# Altium project REO_THE_BOYS.PrjPcb
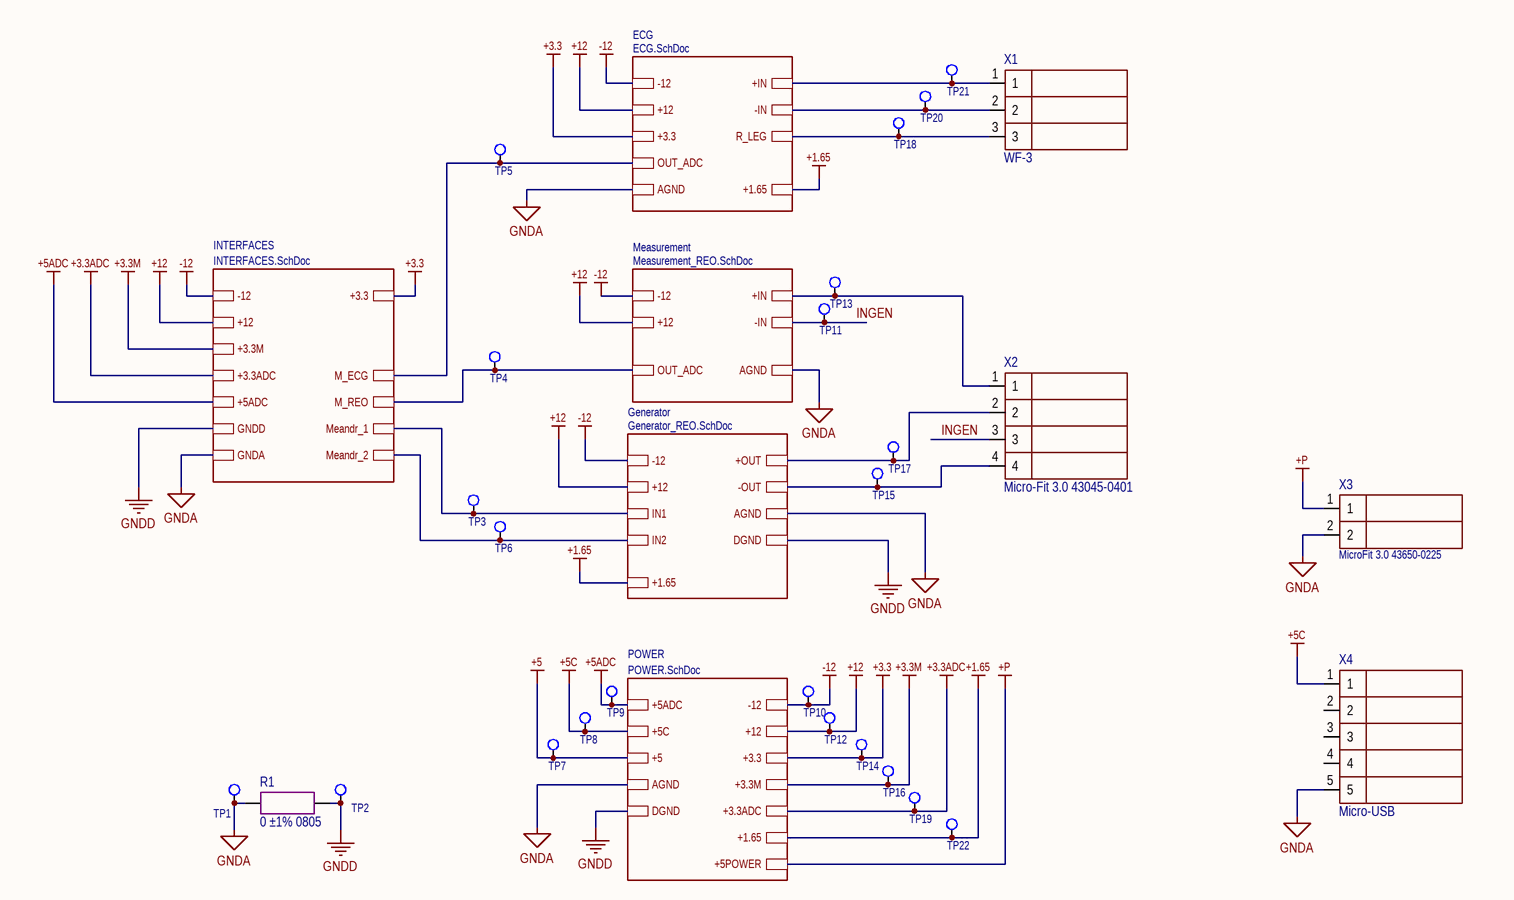
[diagram p0: REO_ECG.SchDoc]
6 sheets, 216 parts. Net scope: hierarchical (ports join the sheet entries above them; power ports are global).
Board file: REO_ECG.PcbDoc
Sheets:
  REO_ECG.SchDoc
    Generator = Generator_REO.SchDoc
    Measurement = Measurement_REO.SchDoc
    POWER = POWER.SchDoc
    ECG = ECG.SchDoc
    INTERFACES = INTERFACES.SchDoc

## Sheet REO_ECG.SchDoc
size 420 x 297 mm; SheetNumber: 1; SheetTotal: 6

### Parts
R1  0 ±1% 0805  [RES: SMD 0805 MD IPC 782]
TP1  Test point  [Test Point]  (value not drawn)  (net tie)
TP2  Test point  [Test Point]  (value not drawn)  (net tie)
TP3  Test point  [Test Point]  (value not drawn)  (net tie)
TP4  Test point  [Test Point]  (value not drawn)  (net tie)
TP5  Test point  [Test Point]  (value not drawn)  (net tie)
TP6  Test point  [Test Point]  (value not drawn)  (net tie)
TP7  Test point  [Test Point]  (value not drawn)  (net tie)
TP8  Test point  [Test Point]  (value not drawn)  (net tie)
TP9  Test point  [Test Point]  (value not drawn)  (net tie)
TP10  Test point  [Test Point]  (value not drawn)  (net tie)
TP11  Test point  [Test Point]  (value not drawn)  (net tie)
TP12  Test point  [Test Point]  (value not drawn)  (net tie)
TP13  Test point  [Test Point]  (value not drawn)  (net tie)
TP14  Test point  [Test Point]  (value not drawn)  (net tie)
TP15  Test point  [Test Point]  (value not drawn)  (net tie)
TP16  Test point  [Test Point]  (value not drawn)  (net tie)
TP17  Test point  [Test Point]  (value not drawn)  (net tie)
TP18  Test point  [Test Point]  (value not drawn)  (net tie)
TP19  Test point  [Test Point]  (value not drawn)  (net tie)
TP20  Test point  [Test Point]  (value not drawn)  (net tie)
TP21  Test point  [Test Point]  (value not drawn)  (net tie)
TP22  Test point  [Test Point]  (value not drawn)  (net tie)
X1  WF-3  [CON: 3pin wf-3]
X2  Micro-Fit 3.0 43045-0401  [CON: 4pin Molex MicroFit 3.0 43045-0401]
X3  MicroFit 3.0 43650-0225  [CON: 2pin Molex MicroFit 3.0 43650-0225]
X4  Micro-USB  [CON: 5pin USB Micro]

### Sub-sheets
ECG = ECG.SchDoc: AGND, -12, +12, +3.3, +IN, -IN, OUT_ADC, R_LEG, +1.65
Generator = Generator_REO.SchDoc: AGND, -OUT, IN1, +OUT, -12, +12, IN2, DGND, +1.65
INTERFACES = INTERFACES.SchDoc: Meandr_1, M_ECG, GNDD, GNDA, M_REO, Meandr_2, +5ADC, +3.3ADC, +3.3M, +12, -12, +3.3
Measurement = Measurement_REO.SchDoc: AGND, -12, +12, +IN, -IN, OUT_ADC
POWER = POWER.SchDoc: AGND, -12, +12, +3.3, +5ADC, +3.3M, +5C, +5, DGND, +3.3ADC, +1.65, +5POWER

### Nets
+1.65: TP22.1 ; sheet Generator/+1.65, sheet POWER/+1.65, sheet ECG/+1.65
+3.3: TP14.1 ; sheet POWER/+3.3, sheet ECG/+3.3, sheet INTERFACES/+3.3
+3.3ADC: TP19.1 ; sheet POWER/+3.3ADC, sheet INTERFACES/+3.3ADC
+3.3M: TP16.1 ; sheet POWER/+3.3M, sheet INTERFACES/+3.3M
+5: TP7.1 ; sheet POWER/+5
+5ADC: TP9.1 ; sheet POWER/+5ADC, sheet INTERFACES/+5ADC
+5C: TP8.1 X4.1 ; sheet POWER/+5C
+12: TP12.1 ; sheet Generator/+12, sheet Measurement/+12, sheet POWER/+12, sheet ECG/+12, sheet INTERFACES/+12
+P: X3.1 ; sheet POWER/+5POWER
-12: TP10.1 ; sheet Generator/-12, sheet Measurement/-12, sheet POWER/-12, sheet ECG/-12, sheet INTERFACES/-12
GNDA: R1.1 TP1.1 X3.2 X4.5 ; sheet Generator/AGND, sheet Measurement/AGND, sheet POWER/AGND, sheet ECG/AGND, sheet INTERFACES/GNDA
GNDD: R1.2 TP2.1 ; sheet Generator/DGND, sheet POWER/DGND, sheet INTERFACES/GNDD  [project net GND]
INGEN: TP11.1 X2.3 ; sheet Measurement/-IN
M1: TP3.1 ; sheet Generator/IN1, sheet INTERFACES/Meandr_1
M2: TP6.1 ; sheet Generator/IN2, sheet INTERFACES/Meandr_2
NetC7_1: TP15.1 X2.4 ; sheet Generator/-OUT
NetC8_1: TP17.1 X2.2 ; sheet Generator/+OUT
NetC32_2: TP13.1 X2.1 ; sheet Measurement/+IN
NetC40_2: TP20.1 X1.2 ; sheet ECG/-IN
NetC41_2: TP21.1 X1.1 ; sheet ECG/+IN
NetC42_2: TP18.1 X1.3 ; sheet ECG/R_LEG
NetC47_1: TP5.1 ; sheet ECG/OUT_ADC, sheet INTERFACES/M_ECG
NetDA14_1: TP4.1 ; sheet Measurement/OUT_ADC, sheet INTERFACES/M_REO

Not connected (* = marked no-connect by the designer): X4 2 3 4

### Notes on the sheet
- Перв. примен.
- 3707.00000000 ЭИТ-1
- Справ. №
- Подп. и дата
- Инв. № дубл.
- Взам. инв. №
- Разраб.
- Изм.
- Лист
- № докум.
- Подп.
- Дата
- Лит.
- Масса
- Масштаб
- Пров.
- Т.контр.
- Листов
- Инв. № подл.
- Утв.
- Н.контр.
- 2.106-A3
- Копировал
- Формат А3

### Library data of the parts
R1 = 0 ±1% 0805: Code: 6094342239; Name: Резистор 0R ±1% 0805
X1 = 3 pin WF-3: Code: 6313932013; Name: Вилка WF-3
X2 = 4 pin MicroFit DR R Molex: Code: *; Name: *
X3 = 2 pin MicroFit SR Molex: Name: Вилка Micro-Fit 3.0 43650-0225, Molex; Code: 6319211711
X4 = 5 pin USB Micro SMD: Code: 6319209171; Name: Розетка 10118194-0001LF, Amphenol

## Sheet Generator_REO.SchDoc
size 420 x 297 mm; SheetNumber: 2; SheetTotal: 6
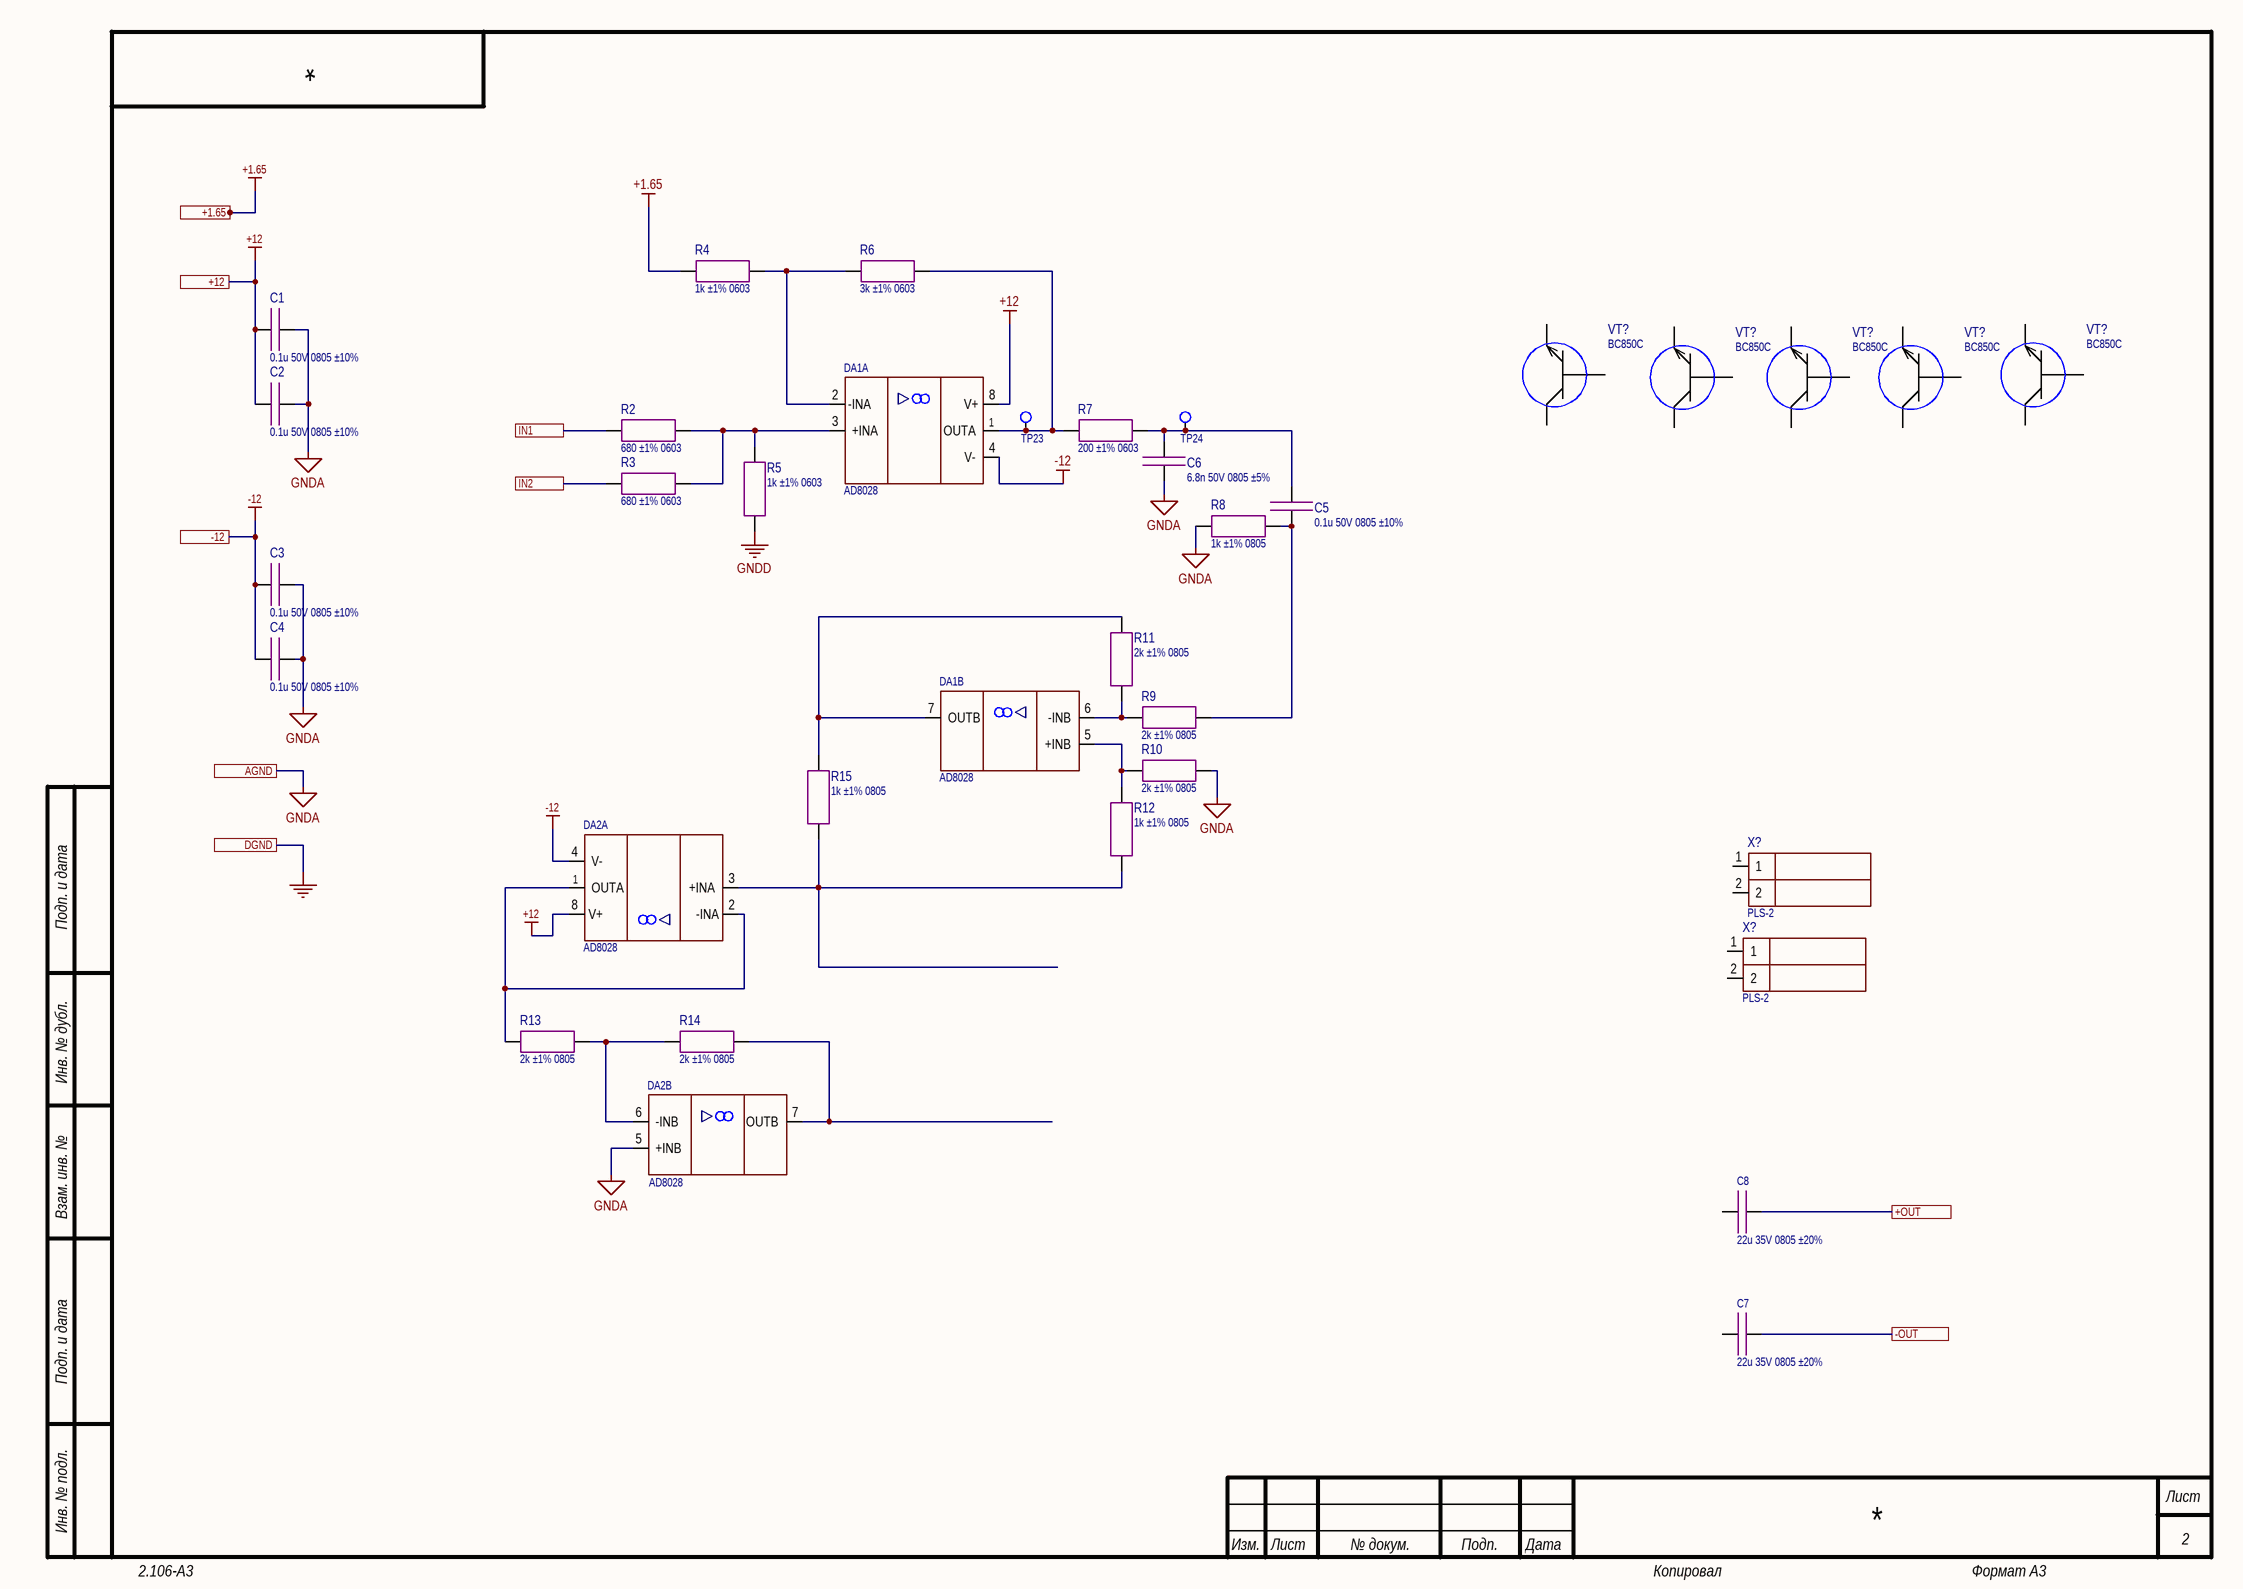
[diagram p1: Generator_REO.SchDoc]

### Parts
(Parts that share a designator on the sheet are numbered #1, #2 ... from top to bottom, then left to right.)
C1  0.1u 50V 0805 ±10%  [CAP: SMD 0805 MD IPC 782]
C2  0.1u 50V 0805 ±10%  [CAP: SMD 0805 MD IPC 782]
C3  0.1u 50V 0805 ±10%  [CAP: SMD 0805 MD IPC 782]
C4  0.1u 50V 0805 ±10%  [CAP: SMD 0805 MD IPC 782]
C5  0.1u 50V 0805 ±10%  [CAP: SMD 0805 MD IPC 782]
C6  6.8n 50V 0805 ±5%  [CAP: SMD 0805 MD IPC 782]
C7  22u 35V 0805 ±20%  [CAP: SMD 0805 MD IPC 782]
C8  22u 35V 0805 ±20%  [CAP: SMD 0805 MD IPC 782]
DA1  AD8028  [IC: SOIC 8]  (parts A,B of 2)
DA2  AD8028  [IC: SOIC 8]  (parts A,B of 2)
R2  680 ±1% 0603  [RES: SMD 0603 MD IPC 782]
R3  680 ±1% 0603  [RES: SMD 0603 MD IPC 782]
R4  1k ±1% 0603  [RES: SMD 0603 MD IPC 782]
R5  1k ±1% 0603  [RES: SMD 0603 MD IPC 782]
R6  3k ±1% 0603  [RES: SMD 0603 MD IPC 782]
R7  200 ±1% 0603  [RES: SMD 0603 MD IPC 782]
R8  1k ±1% 0805  [RES: SMD 0805 MD IPC 782]
R9  2k ±1% 0805  [RES: SMD 0805 MD IPC 782]
R10  2k ±1% 0805  [RES: SMD 0805 MD IPC 782]
R11  2k ±1% 0805  [RES: SMD 0805 MD IPC 782]
R12  1k ±1% 0805  [RES: SMD 0805 MD IPC 782]
R13  2k ±1% 0805  [RES: SMD 0805 MD IPC 782]
R14  2k ±1% 0805  [RES: SMD 0805 MD IPC 782]
R15  1k ±1% 0805  [RES: SMD 0805 MD IPC 782]
TP23  Test point  [Test Point]  (value not drawn)  (net tie)
TP24  Test point  [Test Point]  (value not drawn)  (net tie)
VT?#1  BC850C  [IC: SOT 23]
VT?#2  BC850C  [IC: SOT 23]
VT?#3  BC850C  [IC: SOT 23]
VT?#4  BC850C  [IC: SOT 23]
VT?#5  BC850C  [IC: SOT 23]
X?#1  PLS-2  [CON: 2PIN PLS 2]
X?#2  PLS-2  [CON: 2PIN PLS 2]

### Ports
+1.65 (see REO_ECG[2C], ECG[4A], POWER[1A]), +12 (see REO_ECG[2B], ECG[4A], INTERFACES[4A], Measurement_REO[4A], POWER[1B]), +OUT (see REO_ECG[3B]), -12 (see REO_ECG[2B], ECG[4A], INTERFACES[4A], Measurement_REO[4A], POWER[1B]), -OUT (see REO_ECG[3B]), AGND (see REO_ECG[3B], ECG[4B], Measurement_REO[4A], POWER[1B]), DGND (see REO_ECG[3B], POWER[1B]), IN1 (see REO_ECG[2B]), IN2 (see REO_ECG[2B])

### Nets
+1.65: R4.1 ; port +1.65
+12: C1.2 C2.2 DA1.8(V+) DA2.8(V+) ; port +12
-12: C3.2 C4.2 DA1.4(V-) DA2.4(V-) ; port -12
GND: R5.1 ; port DGND  [also labelled GNDD]
GNDA: C1.1 C2.1 C3.1 C4.1 C6.2 DA2.5(+INB) R8.1 R10.2 ; port AGND
M1: R2.1 ; port IN1
M2: R3.1 ; port IN2
NetC5_1: C5.1 R8.2 R9.2
NetC5_2: C5.2 C6.1 R7.2 TP24.1
NetC7_1: C7.1 ; port -OUT
NetC8_1: C8.1 ; port +OUT
NetDA1_1: DA1.1(OUTA) R6.2 R7.1 TP23.1
NetDA1_2: DA1.2(-INA) R4.2 R6.1
NetDA1_3: DA1.3(+INA) R2.2 R3.2 R5.2
NetDA1_5: DA1.5(+INB) R10.1 R12.2
NetDA1_6: DA1.6(-INB) R9.1 R11.2
NetDA1_7: DA1.7(OUTB) R11.1 R15.1
NetDA2_1: DA2.1(OUTA) DA2.2(-INA) R13.1
NetDA2_3: DA2.3(+INA) R12.1 R15.2
NetDA2_6: DA2.6(-INB) R13.2 R14.1
NetDA2_7: DA2.7(OUTB) R14.2

Not connected (* = marked no-connect by the designer): C7 2; C8 2; VT?#1 1 2 3; VT?#2 1 2 3; VT?#3 1 2 3; VT?#4 1 2 3; VT?#5 1 2 3; X?#1 1 2; X?#2 1 2

### Notes on the sheet
- Подп. и дата
- Инв. № дубл.
- Взам. инв. №
- Инв. № подл.
- Изм.
- Лист
- № докум.
- Подп.
- Дата
- 2.106-A3
- Копировал
- Формат А3

### Library data of the parts
C1-C5 = 0.1u 50V 0805 ±10%: Code: 6279254871; Name: Конденсатор X7R 50V 0,1uF ±10% 0805
C6 = 6.8n 50V 0805 ±5%: Code: 6279352311; Name: Конденсатор NPO 50V 6800pF ±5% 0805
C7 C8 = 22u 35V 0805 ±20%: Code: 6279375691; Name: Конденсатор X5R 35V 22uF±20% 0805
DA1 DA2 = AD8028_part
R2 R3 = 680 ±1% 0603: Code: 6069180761; Name: Резистор 680R ±1% 0603
R4 R5 = 1k ±1% 0603: Code: 6069174188; Name: Резистор 1k ±1% 0603
R6 = 3k ±1% 0603: Code: 6094357331; Name: Резистор 3К ±1% 0603
R7 = 200 ±1% 0603: Code: 6069180621; Name: Резистор 200R±1% 0603
R8 R12 R15 = 1k ±1% 0805: Code: 6027158691; Name: Резистор RC0805FR-071KL, Yageo
R9-R11 R13 R14 = 2k ±1% 0805: Code: 6094352561; Name: Резистор 2k±1%  0805
VT?#1-VT?#5 = BJT NPN BC850C: Code: 6340001151; Name: Транзистор BC850C,215, Nexperia
X?#1 X?#2 = 2 pin PLS 2: Code: 6313952321; Name: Вилка PLS-2

## Sheet Measurement_REO.SchDoc
size 420 x 297 mm; SheetNumber: 4; SheetTotal: 6
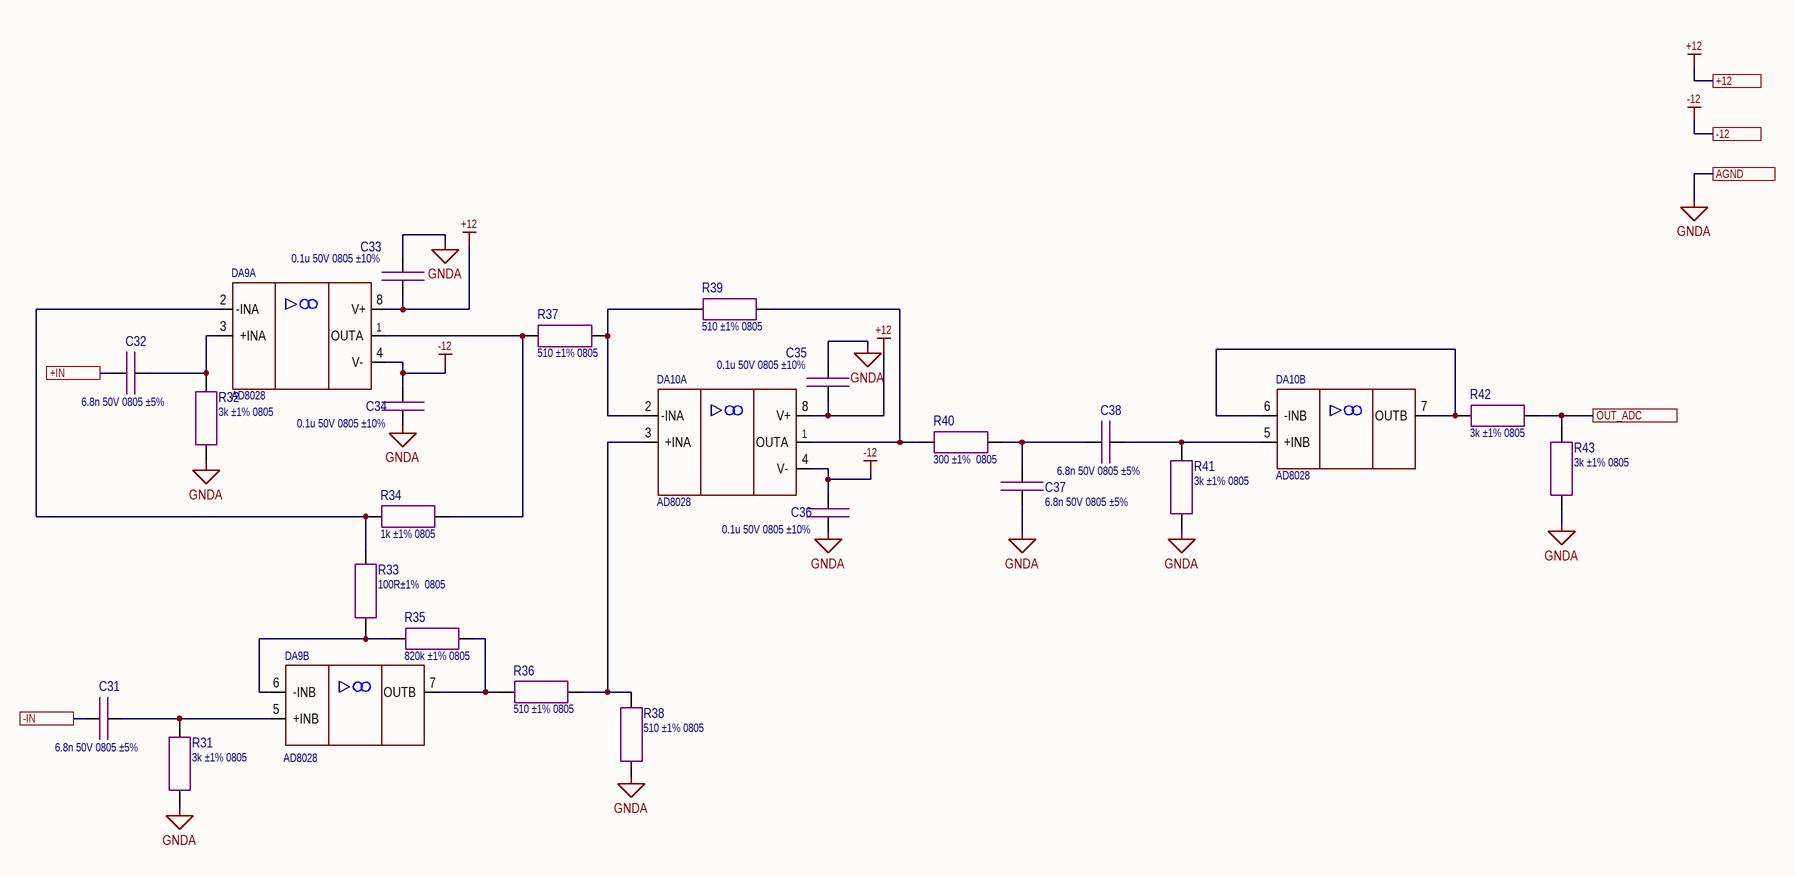
[diagram p2: Measurement_REO.SchDoc]

### Parts
C31  6.8n 50V 0805 ±5%  [CAP: SMD 0805 MD IPC 782]
C32  6.8n 50V 0805 ±5%  [CAP: SMD 0805 MD IPC 782]
C33  0.1u 50V 0805 ±10%  [CAP: SMD 0805 MD IPC 782]
C34  0.1u 50V 0805 ±10%  [CAP: SMD 0805 MD IPC 782]
C35  0.1u 50V 0805 ±10%  [CAP: SMD 0805 MD IPC 782]
C36  0.1u 50V 0805 ±10%  [CAP: SMD 0805 MD IPC 782]
C37  6.8n 50V 0805 ±5%  [CAP: SMD 0805 MD IPC 782]
C38  6.8n 50V 0805 ±5%  [CAP: SMD 0805 MD IPC 782]
DA9  AD8028  [IC: SOIC 8]  (parts A,B of 2)
DA10  AD8028  [IC: SOIC 8]  (parts A,B of 2)
R31  3k ±1% 0805  [RES: SMD 0805 MD IPC 782]
R32  3k ±1% 0805  [RES: SMD 0805 MD IPC 782]
R33  100R±1%  0805  [RES: SMD 0805 MD IPC 782]
R34  1k ±1% 0805  [RES: SMD 0805 MD IPC 782]
R35  820k ±1% 0805  [RES: SMD 0805 MD IPC 782]
R36  510 ±1% 0805  [RES: SMD 0805 MD IPC 782]
R37  510 ±1% 0805  [RES: SMD 0805 MD IPC 782]
R38  510 ±1% 0805  [RES: SMD 0805 MD IPC 782]
R39  510 ±1% 0805  [RES: SMD 0805 MD IPC 782]
R40  300 ±1%  0805  [RES: SMD 0805 MD IPC 782]
R41  3k ±1% 0805  [RES: SMD 0805 MD IPC 782]
R42  3k ±1% 0805  [RES: SMD 0805 MD IPC 782]
R43  3k ±1% 0805  [RES: SMD 0805 MD IPC 782]

### Ports
+12 (see REO_ECG[2B], ECG[4A], Generator_REO[1A], INTERFACES[4A], POWER[1B]), +IN (see REO_ECG[3B]), -12 (see REO_ECG[2B], ECG[4A], Generator_REO[1B], INTERFACES[4A], POWER[1B]), -IN (see REO_ECG[3B]), AGND (see REO_ECG[3B], ECG[4B], Generator_REO[1B], POWER[1B]), OUT_ADC (see REO_ECG[2B])

### Nets
+12: C33.2 C35.2 DA9.8(V+) DA10.8(V+) ; port +12
-12: C34.1 C36.1 DA9.4(V-) DA10.4(V-) ; port -12
GNDA: C33.1 C34.2 C35.1 C36.2 C37.2 R31.2 R32.2 R38.1 R41.2 R43.1 ; port AGND
INGEN: C31.2 ; port -IN
NetC31_1: C31.1 DA9.5(+INB) R31.1
NetC32_1: C32.1 DA9.3(+INA) R32.1
NetC32_2: C32.2 ; port +IN
NetC37_1: C37.1 C38.2 R40.2
NetC38_1: C38.1 DA10.5(+INB) R41.1
NetDA9_1: DA9.1(OUTA) R34.1 R37.1
NetDA9_2: DA9.2(-INA) R33.2 R34.2
NetDA9_6: DA9.6(-INB) R33.1 R35.2
NetDA9_7: DA9.7(OUTB) R35.1 R36.1
NetDA10_1: DA10.1(OUTA) R39.2 R40.1
NetDA10_2: DA10.2(-INA) R37.2 R39.1
NetDA10_3: DA10.3(+INA) R36.2 R38.2
NetDA10_6: DA10.6(-INB) DA10.7(OUTB) R42.1
NetDA14_1: R42.2 R43.2 ; port OUT_ADC

### Notes on the sheet
- Подп. и дата
- Инв. № дубл.
- Взам. инв. №
- Инв. № подл.
- Изм.
- Лист
- № докум.
- Подп.
- Дата
- 2.106-A3
- Копировал
- Формат А3

### Library data of the parts
C31 C32 C37 C38 = 6.8n 50V 0805 ±5%: as C6 on sheet Generator_REO
C33-C36 = 0.1u 50V 0805 ±10%: as C1 on sheet Generator_REO
DA9 DA10 = AD8028_part
R31 R32 R41-R43 = 3k ±1% 0805: Code: 6094357331; Name: Резистор 3К ±1% 0805
R33 = 100 ±1%  0805: Code: 6094351171; Name: Резистор 100R±1%  0805
R34 = 1k ±1% 0805: as R8 on sheet Generator_REO
R35 = 820k ±1% 0805: Code: 6019041741; Name: Резистор RC0805FR-07820KL, Yageo
R36-R39 = 510 ±1% 0805: Code: 6069137191; Name: Резистор 510R±1%  0805
R40 = 300 ±1%  0805: Code: 6094357025; Name: Резистор 300R±1%  0805

## Sheet POWER.SchDoc
size 420 x 297 mm; SheetNumber: 3; SheetTotal: 6
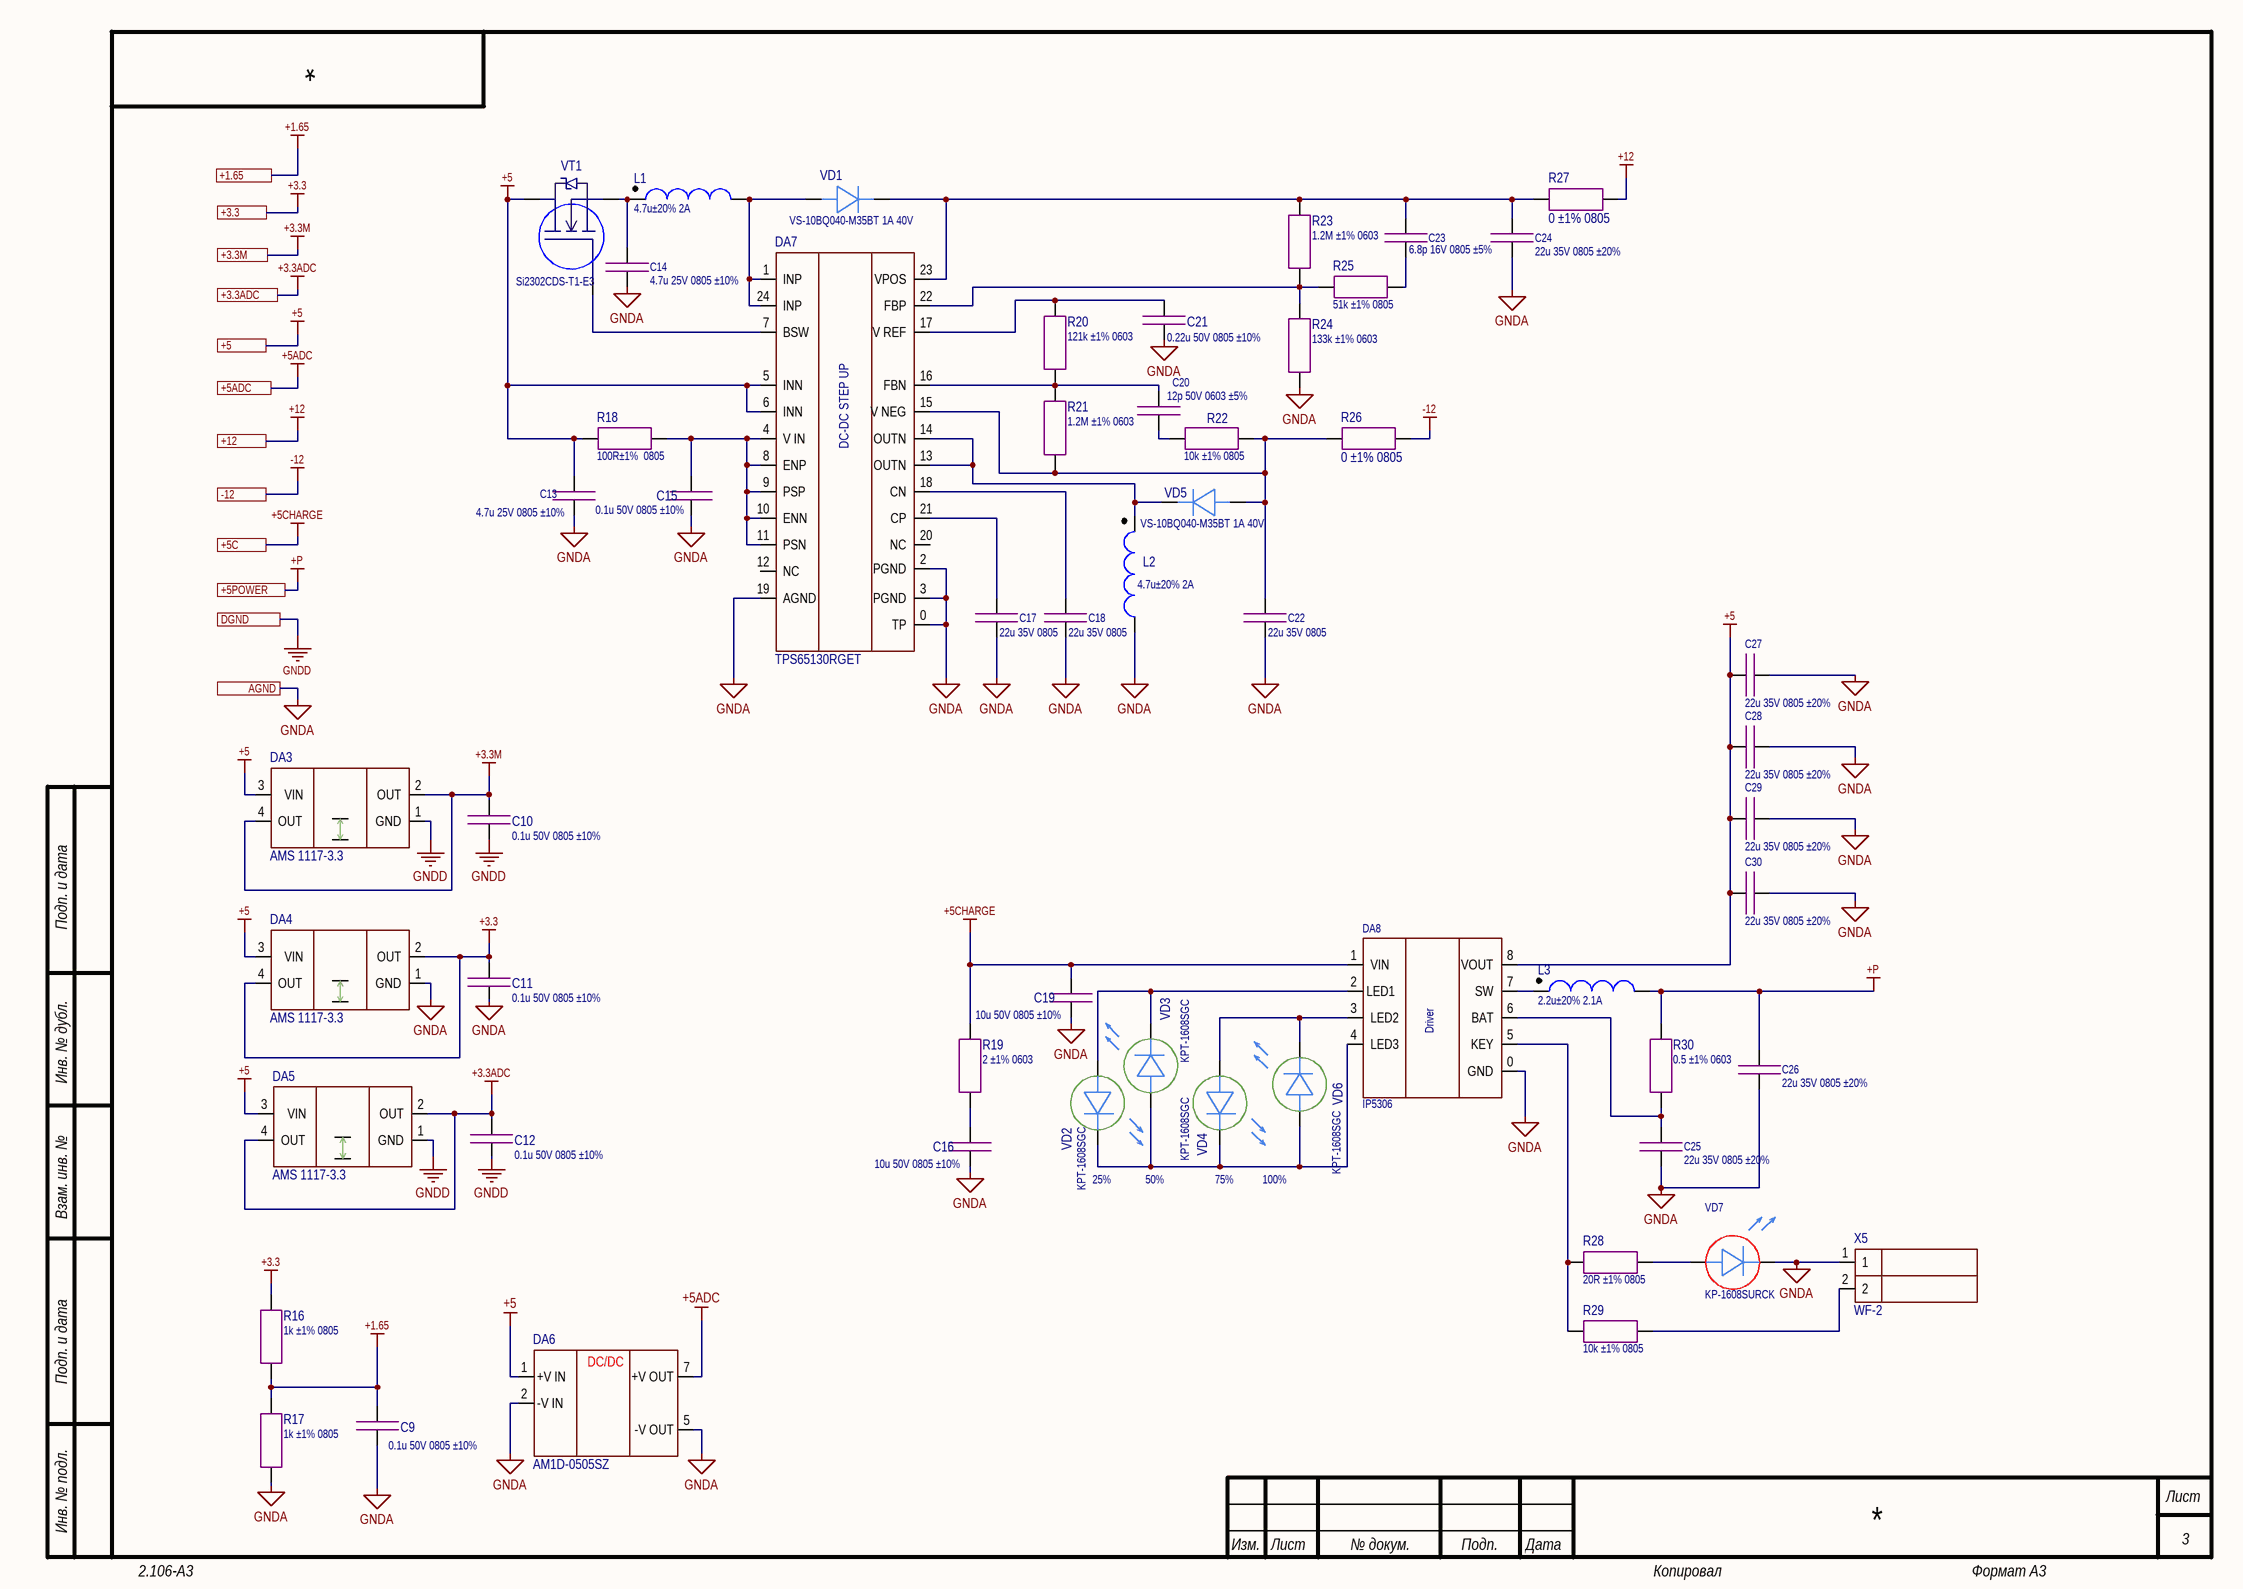
[diagram p3: POWER.SchDoc]

### Parts
C9  0.1u 50V 0805 ±10%  [CAP: SMD 0805 MD IPC 782]
C10  0.1u 50V 0805 ±10%  [CAP: SMD 0805 MD IPC 782]
C11  0.1u 50V 0805 ±10%  [CAP: SMD 0805 MD IPC 782]
C12  0.1u 50V 0805 ±10%  [CAP: SMD 0805 MD IPC 782]
C13  4.7u 25V 0805 ±10%  [CAP: SMD 0805 MD IPC 782]
C14  4.7u 25V 0805 ±10%  [CAP: SMD 0805 MD IPC 782]
C15  0.1u 50V 0805 ±10%  [CAP: SMD 0805 MD IPC 782]
C16  10u 50V 0805 ±10%  [CAP: SMD 0805 MD IPC 782]
C17  22u 35V 0805  [CAP: SMD 0805 MD IPC 782]
C18  22u 35V 0805  [CAP: SMD 0805 MD IPC 782]
C19  10u 50V 0805 ±10%  [CAP: SMD 0805 MD IPC 782]
C20  12p 50V 0603 ±5%  [CAP: SMD 0603 MD IPC 782]
C21  0.22u 50V 0805 ±10%  [CAP: SMD 0805 MD IPC 782]
C22  22u 35V 0805  [CAP: SMD 0805 MD IPC 782]
C23  6.8p 16V 0805 ±5%  [CAP: SMD 0805 MD IPC 782]
C24  22u 35V 0805 ±20%  [CAP: SMD 0805 MD IPC 782]
C25  22u 35V 0805 ±20%  [CAP: SMD 0805 MD IPC 782]
C26  22u 35V 0805 ±20%  [CAP: SMD 0805 MD IPC 782]
C27  22u 35V 0805 ±20%  [CAP: SMD 0805 MD IPC 782]
C28  22u 35V 0805 ±20%  [CAP: SMD 0805 MD IPC 782]
C29  22u 35V 0805 ±20%  [CAP: SMD 0805 MD IPC 782]
C30  22u 35V 0805 ±20%  [CAP: SMD 0805 MD IPC 782]
DA3  AMS 1117-3.3  [IC: SOT 223]
DA4  AMS 1117-3.3  [IC: SOT 223]
DA5  AMS 1117-3.3  [IC: SOT 223]
DA6  AM1D-0505SZ  [AM1D]
DA7  TPS65130RGET  [IC: PVQFN 24]
DA8  IP5306  [IC: SOIC 8 TP]
L1  4.7u±20% 2A  [IND: LPS5030]
L2  4.7u±20% 2A  [IND: LPS5030]
L3  2.2u±20% 2.1A  [IND: LPS3015]
R16  1k ±1% 0805  [RES: SMD 0805 MD IPC 782]
R17  1k ±1% 0805  [RES: SMD 0805 MD IPC 782]
R18  100R±1%  0805  [RES: SMD 0805 MD IPC 782]
R19  2 ±1% 0603  [RES: SMD 0603 MD IPC 782]
R20  121k ±1% 0603  [RES: SMD 0603 MD IPC 782]
R21  1.2M ±1% 0603  [RES: SMD 0603 MD IPC 782]
R22  10k ±1% 0805  [RES: SMD 0805 MD IPC 782]
R23  1.2M ±1% 0603  [RES: SMD 0603 MD IPC 782]
R24  133k ±1% 0603  [RES: SMD 0603 MD IPC 782]
R25  51k ±1% 0805  [RES: SMD 0805 MD IPC 782]
R26  0 ±1% 0805  [RES: SMD 0805 MD IPC 782]
R27  0 ±1% 0805  [RES: SMD 0805 MD IPC 782]
R28  20R ±1% 0805  [RES: SMD 0805 MD IPC 782]
R29  10k ±1% 0805  [RES: SMD 0805 MD IPC 782]
R30  0.5 ±1% 0603  [RES: SMD 0603 MD IPC 782]
VD1  VS-10BQ040-M35BT 1A 40V  [DIODE: SMB]
VD2  KPT-1608SGC  [DIODE: LED 0603(1608) green]
VD3  KPT-1608SGC  [DIODE: LED 0603(1608) green]
VD4  KPT-1608SGC  [DIODE: LED 0603(1608) green]
VD5  VS-10BQ040-M35BT 1A 40V  [DIODE: SMB]
VD6  KPT-1608SGC  [DIODE: LED 0603(1608) green]
VD7  KP-1608SURCK  [DIODE: LED 0603(1608) red]
VT1  Si2302CDS-T1-E3  [IC: SOT 23]
X5  WF-2  [CON: 2pin wf-2]

### Ports
+1.65 (see REO_ECG[3C], ECG[4A], Generator_REO[1A]), +3.3 (see REO_ECG[3C], ECG[4A], INTERFACES[4A]), +3.3ADC (see REO_ECG[3C], INTERFACES[4A]), +3.3M (see REO_ECG[3C], INTERFACES[4A]), +5 (see REO_ECG[2C]), +5ADC (see REO_ECG[2C], INTERFACES[4A]), +5C (see REO_ECG[2C]), +5POWER (see REO_ECG[3C]), +12 (see REO_ECG[3C], ECG[4A], Generator_REO[1A], INTERFACES[4A], Measurement_REO[4A]), -12 (see REO_ECG[3C], ECG[4A], Generator_REO[1B], INTERFACES[4A], Measurement_REO[4A]), AGND (see REO_ECG[2C], ECG[4B], Generator_REO[1B], Measurement_REO[4A]), DGND (see REO_ECG[2C], Generator_REO[1C])

### Nets
+1.65: C9.1 R16.1 R17.2 ; port +1.65
+3.3: C11.1 DA4.2(OUT) DA4.4(OUT) R16.2 ; port +3.3
+3.3ADC: C12.1 DA5.2(OUT) DA5.4(OUT) ; port +3.3ADC
+3.3M: C10.1 DA3.2(OUT) DA3.4(OUT) ; port +3.3M
+5: C13.1 C27.1 C28.1 C29.1 C30.1 DA3.3(VIN) DA4.3(VIN) DA5.3(VIN) DA6.1(+V_IN) DA7.5(INN) DA7.6(INN) DA8.8(VOUT) R18.1 VT1.3 ; port +5
+5ADC: DA6.7(+V_OUT) ; port +5ADC
+5CHARGE: C19.1 DA8.1(VIN) R19.2 ; port +5C  [project net +5C]
+12: R27.2 ; port +12
+P: C26.1 L3.2 R30.2 ; port +5POWER
-12: R26.2 ; port -12
GNDA: C9.2 C11.2 C13.2 C14.2 C15.2 C16.2 C17.2 C18.2 C19.2 C21.2 C22.2 C24.2 C25.2 C26.2 C27.2 C28.2 C29.2 C30.2 DA4.1(GND) DA6.2(-V_IN) DA6.5(-V_OUT) DA7.0(TP) DA7.2(PGND) DA7.3(PGND) DA7.19(AGND) DA8.0(GND) L2.2 R17.1 R24.1 VD7.1 X5.1 ; port AGND
GNDD: C10.2 C12.2 DA3.1(GND) DA5.1(GND) ; port DGND  [project net GND]
NetC14_1: C14.1 L1.1 VT1.2
NetC15_1: C15.1 DA7.4(V_IN) DA7.8(ENP) DA7.9(PSP) DA7.10(ENN) DA7.11(PSN) R18.2
NetC16_1: C16.1 R19.1
NetC17_1: C17.1 DA7.21(CP)
NetC18_1: C18.1 DA7.18(CN)
NetC20_1: C20.1 DA7.16(FBN) R20.1 R21.2
NetC20_2: C20.2 R22.1
NetC21_1: C21.1 DA7.17(V_REF) R20.2
NetC22_1: C22.1 DA7.15(V_NEG) R21.1 R22.2 R26.1 VD5.2
NetC23_1: C23.1 C24.1 DA7.23(VPOS) R23.2 R27.1 VD1.1
NetC23_2: C23.2 R25.2
NetC25_1: C25.1 DA8.6(BAT) R30.1
NetDA7_1: DA7.1(INP) DA7.24(INP) L1.2 VD1.2
NetDA7_7: DA7.7(BSW) VT1.1
NetDA7_13: DA7.13(OUTN) DA7.14(OUTN) L2.1 VD5.1
NetDA7_22: DA7.22(FBP) R23.1 R24.2 R25.1
NetDA8_2: DA8.2(LED1) VD2.2 VD3.1
NetDA8_3: DA8.3(LED2) VD4.2 VD6.1
NetDA8_4: DA8.4(LED3) VD2.1 VD3.2 VD4.1 VD6.2
NetDA8_5: DA8.5(KEY) R28.1 R29.1
NetDA8_7: DA8.7(SW) L3.1
NetR28_2: R28.2 VD7.2
NetR29_2: R29.2 X5.2

Not connected (* = marked no-connect by the designer): DA7 12(NC) 20(NC)

### Notes on the sheet
- (near VD2) 25%
- 50%
- (near VD4) 75%
- 100%
- Подп. и дата
- Инв. № дубл.
- Взам. инв. №
- Инв. № подл.
- Изм.
- Лист
- № докум.
- Подп.
- Дата
- 2.106-A3
- Копировал
- Формат А3
- (in symbol DC-DC: 3-15/-15V TPS65130RGET) DC-DC STEP UP
- (in symbol DC-DC: 5-5V AM1D-0505SZ) DC/DC
- (in symbol IP5306) Driver

### Library data of the parts
C9-C12 C15 = 0.1u 50V 0805 ±10%: as C1 on sheet Generator_REO
C13 C14 = 4.7u 25V 0805 ±10%: Code: 6270000501; Name: Конденсатор X7R 25V 4,7uF±10% 0805
C16 C19 = 10u 50V 0805 ±10%: Code: 6289735441; Name: Конденсатор 12065D106KAT2A, AVX
C17 C18 C22 C24-C30 = 22u 35V 0805 ±20%: as C7 on sheet Generator_REO
C20 = 12p 50V 0603 ±5%: Code: 6279238291; Name: Конденсатор NP0 50V 12pF±5% 0603
C21 = 0.22u 50V 0805 ±10%: Name: Конденсатор 0805B224K500NT, Fenghua
C23 = 6.8p 50V 0805 ±5%: Code: 6219233221; Name: Конденсатор COG 16V 6.8pF±5% 0805
DA3-DA5 = LDO: 15-3.3V AMS1117: Code: 6339112951; Name: Микросхема AMS-1117-3.3
DA6 = DC-DC: 5-5V AM1D-0505SZ: Name: Микросхема AM1D-0505SZ, AIMTEC
DA7 = DC-DC: 3-15/-15V TPS65130RGET: Code: 6339113561; Name: Микросхема TPS65130RGET, TI
L1 L2 = 4.7u±20% 2A: LPS5030; Code: 6339119781; Name: Микросхема LPS5030-472MR(B), Coilcraft
L3 = 2.2u±20% 2.1A: LPS3015; Code: 6319247691; Name: Дроссель LPS3015-222MRC, Coilcraft
R16 R17 = 1k ±1% 0805: as R8 on sheet Generator_REO
R18 = 100 ±1%  0805: as R33 on sheet Measurement_REO
R19 = 2 ±1% 0603: Code: 6069180891; Name: Резистор 2,2k ±1% 0603
R20 = 121k ±1% 0603: Code: 6060001691; Name: Резистор 121K±1% 0603
R21 R23 = 1.2M ±1% 0603: Code: 6069194591; Name: Резистор 1,2M±1% ТК50 0603
R22 R29 = 10k ±1% 0805: Code: 6020003061; Name: Резистор RC0805JR-0710KL
R24 = 133k ±1% 0603: Code: 6027155891; Name: Резистор CRCW0603133KFKEA, Vishay
R25 = 51k ±1% 0805: Code: 6094354057; Name: Резистор 51K±1% 0805
R26 R27 = 0 ±1% 0805: as R1 on sheet REO_ECG
R28 = 20R ±1% 0805: Code: 6094357581; Name: 20R ±1% 0805
R30 = 0.5 ±1% 0603: Name: Резистор 0.5 ±1% 0603
VD1 VD5 = Rectifier 1A 40V: Code: 6349982351; Name: Диод VS-10BQ040-M35BT, Vishay
VD2-VD4 VD6 = LED green 0603: Code: 6340003921; Name: Светодиод KPT-1608SGC, Kingbright
VD7 = LED red 0603: Code: 6349551609; Name: Светодиод KP-1608SURCK
VT1 = MOS N Si2302CDS-T1-E3: Code: 6349982201; Name: Транзистор Si2302CDS-T1-E3,  Vishay
X5 = 2 pin WF-2: Code: 6313952902; Name: Вилка WF-2

## Sheet ECG.SchDoc
size 420 x 297 mm; SheetNumber: 5; SheetTotal: 6
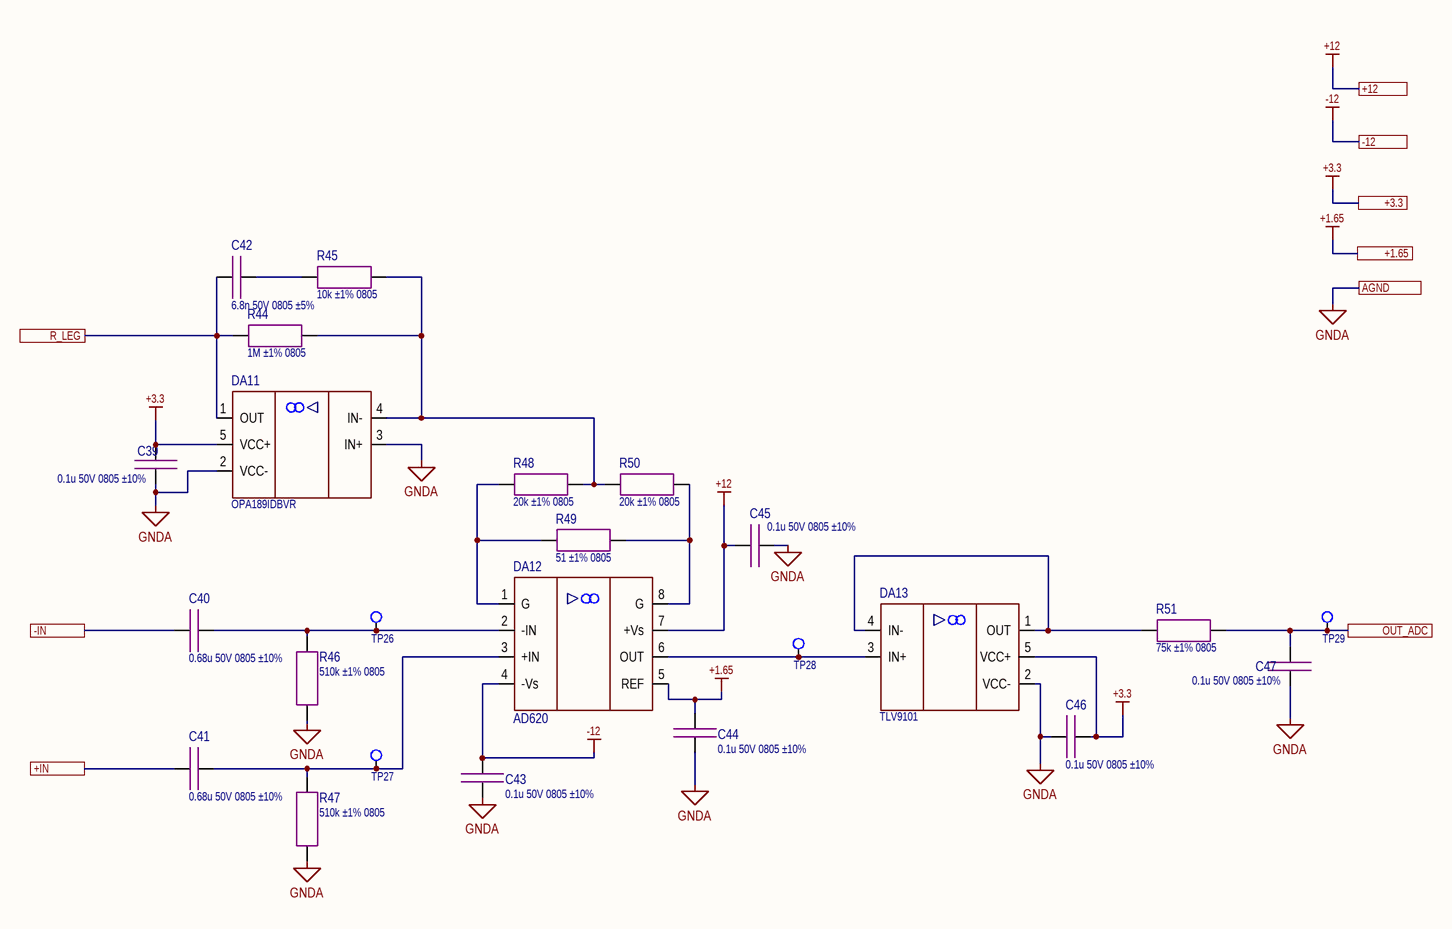
[diagram p4: ECG.SchDoc]

### Parts
C39  0.1u 50V 0805 ±10%  [CAP: SMD 0805 MD IPC 782]
C40  0.68u 50V 0805 ±10%  [CAP: SMD 0805 MD IPC 782]
C41  0.68u 50V 0805 ±10%  [CAP: SMD 0805 MD IPC 782]
C42  6.8n 50V 0805 ±5%  [CAP: SMD 0805 MD IPC 782]
C43  0.1u 50V 0805 ±10%  [CAP: SMD 0805 MD IPC 782]
C44  0.1u 50V 0805 ±10%  [CAP: SMD 0805 MD IPC 782]
C45  0.1u 50V 0805 ±10%  [CAP: SMD 0805 MD IPC 782]
C46  0.1u 50V 0805 ±10%  [CAP: SMD 0805 MD IPC 782]
C47  0.1u 50V 0805 ±10%  [CAP: SMD 0805 MD IPC 782]
DA11  OPA189IDBVR  [IC: SOT 23 5pin]
DA12  AD620  [IC: SOIC 8]
DA13  TLV9101  [IC: SOT 23 5pin]
R44  1M ±1% 0805  [RES: SMD 0805 MD IPC 782]
R45  10k ±1% 0805  [RES: SMD 0805 MD IPC 782]
R46  510k ±1% 0805  [RES: SMD 0805 MD IPC 782]
R47  510k ±1% 0805  [RES: SMD 0805 MD IPC 782]
R48  20k ±1% 0805  [RES: SMD 0805 MD IPC 782]
R49  51 ±1% 0805  [RES: SMD 0805 MD IPC 782]
R50  20k ±1% 0805  [RES: SMD 0805 MD IPC 782]
R51  75k ±1% 0805  [RES: SMD 0805 MD IPC 782]
TP26  Test point  [Test Point]  (value not drawn)  (net tie)
TP27  Test point  [Test Point]  (value not drawn)  (net tie)
TP28  Test point  [Test Point]  (value not drawn)  (net tie)
TP29  Test point  [Test Point]  (value not drawn)  (net tie)

### Ports
+1.65 (see REO_ECG[3B], Generator_REO[1A], POWER[1A]), +3.3 (see REO_ECG[2A], INTERFACES[4A], POWER[1A]), +12 (see REO_ECG[2A], Generator_REO[1A], INTERFACES[4A], Measurement_REO[4A], POWER[1B]), +IN (see REO_ECG[3A]), -12 (see REO_ECG[2A], Generator_REO[1B], INTERFACES[4A], Measurement_REO[4A], POWER[1B]), -IN (see REO_ECG[3A]), AGND (see REO_ECG[2B], Generator_REO[1B], Measurement_REO[4A], POWER[1B]), OUT_ADC (see REO_ECG[2B]), R_LEG (see REO_ECG[3A])

### Nets
+1.65: C44.2 DA12.5(REF) ; port +1.65
+3.3: C39.1 C46.1 DA11.5(VCC+) DA13.5(VCC+) ; port +3.3
+12: C45.1 DA12.7(+Vs) ; port +12
-12: C43.1 DA12.4(-Vs) ; port -12
GNDA: C39.2 C43.2 C44.1 C45.2 C46.2 C47.2 DA11.2(VCC-) DA11.3(IN+) DA13.2(VCC-) R46.1 R47.1 ; port AGND
NetC40_1: C40.1 DA12.2(-IN) R46.2 TP26.1
NetC40_2: C40.2 ; port -IN
NetC41_1: C41.1 DA12.3(+IN) R47.2 TP27.1
NetC41_2: C41.2 ; port +IN
NetC42_1: C42.1 R45.1
NetC42_2: C42.2 DA11.1(OUT) R44.1 ; port R_LEG
NetC47_1: C47.1 R51.2 TP29.1 ; port OUT_ADC
NetDA11_4: DA11.4(IN-) R44.2 R45.2 R48.2 R50.1
NetDA12_1: DA12.1(G) R48.1 R49.1
NetDA12_6: DA12.6(OUT) DA13.3(IN+) TP28.1
NetDA12_8: DA12.8(G) R49.2 R50.2
NetDA13_1: DA13.1(OUT) DA13.4(IN-) R51.1

### Notes on the sheet
- Подп. и дата
- Инв. № дубл.
- Взам. инв. №
- Инв. № подл.
- Изм.
- Лист
- № докум.
- Подп.
- Дата
- 2.106-A3
- Копировал
- Формат А3

### Library data of the parts
C39 C43-C47 = 0.1u 50V 0805 ±10%: as C1 on sheet Generator_REO
C40 C41 = 0.68u 50V 0805 ±10%: Name: Конденсатор 0805B224K500NT, Fenghua
C42 = 6.8n 50V 0805 ±5%: as C6 on sheet Generator_REO
DA11 = OPA189IDBVR: Name: Микросхема OPA189IDBVR
DA13 = TLV9101: Code: 6339115821; Name: Микросхема TLV9101IDBVR
R44 = 1M ±1% 0805: Name: Резистор RC0805FR-071KL, Yageo
R45 = 10k ±1% 0805: as R22 on sheet POWER
R46 R47 = 510k ±1% 0805: Code: 6094357031; Name: Резистор 510K±1% 0805
R48 R50 = 20k ±1% 0805: Code: 6094357581; Name: Резистор 20K±1% 0805
R49 = 51 ±1% 0805: Code: 6094354057; Name: Резистор 51K±1% 0805
R51 = 75k ±1% 0805: Name: Резистор 75К±1% 0805

## Sheet INTERFACES.SchDoc
size 594 x 420 mm; SheetNumber: 6; SheetTotal: 6
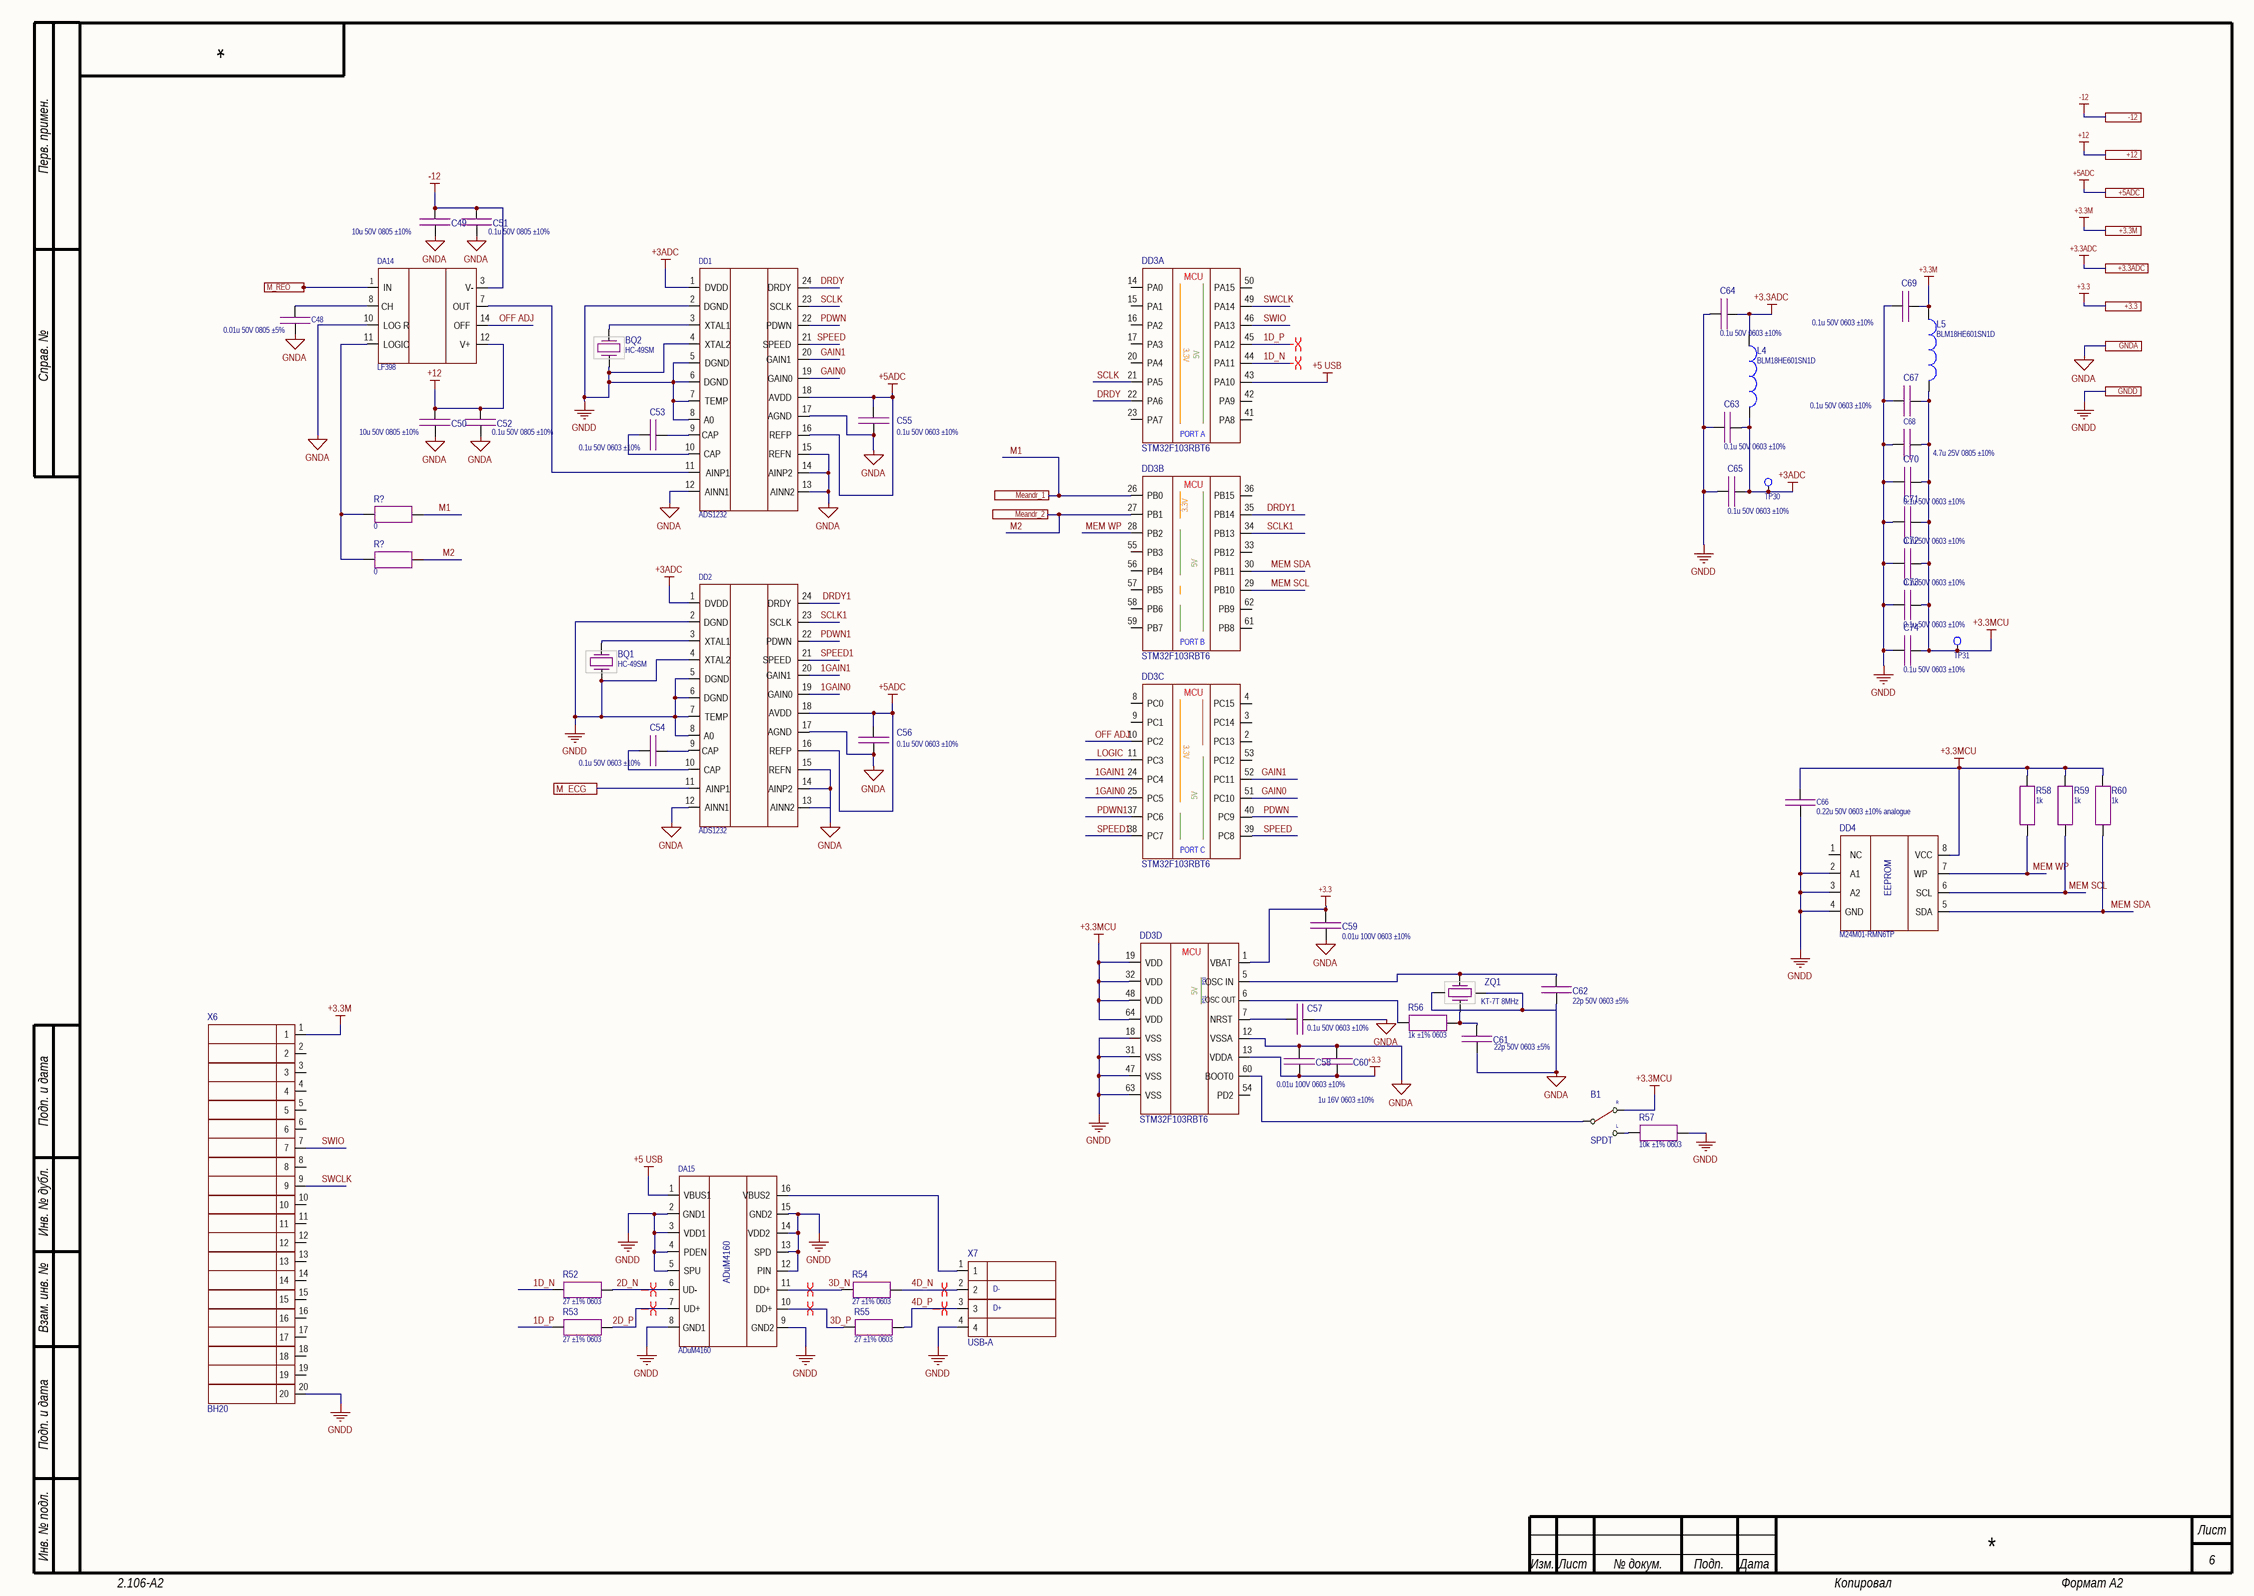
[diagram p5: INTERFACES.SchDoc]

### Parts
(Parts that share a designator on the sheet are numbered #1, #2 ... from top to bottom, then left to right.)
B1  SPDT  [Slide Switch 3 pin]
BQ1  HC-49SM  [CRYSTAL: HC-49SM]
BQ2  HC-49SM  [CRYSTAL: HC-49SM]
C48  0.01u 50V 0805 ±5%  [CAP: SMD 0805 MD IPC 782]
C49  10u 50V 0805 ±10%  [CAP: SMD 0805 MD IPC 782]
C50  10u 50V 0805 ±10%  [CAP: SMD 0805 MD IPC 782]
C51  0.1u 50V 0805 ±10%  [CAP: SMD 0805 MD IPC 782]
C52  0.1u 50V 0805 ±10%  [CAP: SMD 0805 MD IPC 782]
C53  0.1u 50V 0603 ±10%  [CAP: SMD 0603 MD IPC 782]
C54  0.1u 50V 0603 ±10%  [CAP: SMD 0603 MD IPC 782]
C55  0.1u 50V 0603 ±10%  [CAP: SMD 0603 MD IPC 782]
C56  0.1u 50V 0603 ±10%  [CAP: SMD 0603 MD IPC 782]
C57  0.1u 50V 0603 ±10%  [CAP: SMD 0603 MD IPC 782]
C58  0.01u 100V 0603 ±10%  [CAP: SMD 0603 MD IPC 782]
C59  0.01u 100V 0603 ±10%  [CAP: SMD 0603 MD IPC 782]
C60  1u 16V 0603 ±10%  [CAP: SMD 0603 MD IPC 782]
C61  22p 50V 0603 ±5%  [CAP: SMD 0603 MD IPC 782]
C62  22p 50V 0603 ±5%  [CAP: SMD 0603 MD IPC 782]
C63  0.1u 50V 0603 ±10%  [CAP: SMD 0603 MD IPC 782]
C64  0.1u 50V 0603 ±10%  [CAP: SMD 0603 MD IPC 782]
C65  0.1u 50V 0603 ±10%  [CAP: SMD 0603 MD IPC 782]
C66  0.22u 50V 0603 ±10% analogue  [CAP: SMD 0603 MD IPC 782]
C67  0.1u 50V 0603 ±10%  [CAP: SMD 0603 MD IPC 782]
C68  4.7u 25V 0805 ±10%  [CAP: SMD 0805 MD IPC 782]
C69  0.1u 50V 0603 ±10%  [CAP: SMD 0603 MD IPC 782]
C70  0.1u 50V 0603 ±10%  [CAP: SMD 0603 MD IPC 782]
C71  0.1u 50V 0603 ±10%  [CAP: SMD 0603 MD IPC 782]
C72  0.1u 50V 0603 ±10%  [CAP: SMD 0603 MD IPC 782]
C73  0.1u 50V 0603 ±10%  [CAP: SMD 0603 MD IPC 782]
C74  0.1u 50V 0603 ±10%  [CAP: SMD 0603 MD IPC 782]
DA14  LF398  [IC: SOIC 14]
DA15  ADuM4160  [IC: SOIC 16 WIDE]
DD1  ADS1232  [TSSOP-24]
DD2  ADS1232  [TSSOP-24]
DD3  STM32F103RBT6  [MC: LQFP-64]  (parts A,B,C,D of 4)
DD4  M24M01-RMN6TP  [IC: SOIC 8]
L4  BLM18HE601SN1D  [IND: SMD 0603 MD IPC 782]
L5  BLM18HE601SN1D  [IND: SMD 0603 MD IPC 782]
R52  27 ±1% 0603  [IND: SMD 0603 BLM18HE601SN1D]
R53  27 ±1% 0603  [IND: SMD 0603 BLM18HE601SN1D]
R54  27 ±1% 0603  [IND: SMD 0603 BLM18HE601SN1D]
R55  27 ±1% 0603  [IND: SMD 0603 BLM18HE601SN1D]
R56  1k ±1% 0603  [RES: SMD 0603 MD IPC 782]
R57  10k ±1% 0603  [RES: SMD 0603 MD IPC 782]
R58  1k  [RES: SMD 0603 MD IPC 782]
R59  1k  [RES: SMD 0603 MD IPC 782]
R60  1k  [RES: SMD 0603 MD IPC 782]
R?#1  0  [RES: SMD 0603 MD IPC 782]
R?#2  0  [RES: SMD 0603 MD IPC 782]
TP30  Test point  [Test Point]  (value not drawn)  (net tie)
TP31  Test point  [Test Point]  (value not drawn)  (net tie)
X6  BH20  [CON: BH-20]
X7  USB-A  [CON: 4PIN USB B]
ZQ1  KT-7T 8MHz  [CRYSTAL: 3225 4pin]

### Ports
+3.3 (see REO_ECG[2B], ECG[4A], POWER[1A]), +3.3ADC (see REO_ECG[2B], POWER[1A]), +3.3M (see REO_ECG[2B], POWER[1A]), +5ADC (see REO_ECG[2B], POWER[1A]), +12 (see REO_ECG[2B], ECG[4A], Generator_REO[1A], Measurement_REO[4A], POWER[1B]), -12 (see REO_ECG[2B], ECG[4A], Generator_REO[1B], Measurement_REO[4A], POWER[1B]), GNDA (see REO_ECG[2B]), GNDD (see REO_ECG[2B]), M_ECG (see REO_ECG[2B]), M_REO (see REO_ECG[2B]), Meandr_1 (see REO_ECG[2B]), Meandr_2 (see REO_ECG[2B])

### Nets
+3.3: C58.2 C59.1 C60.2 DD3.1(VBAT) DD3.13(VDDA) ; port +3.3
+3.3ADC: C64.2 L4.1 ; port +3.3ADC
+3.3M: C69.2 L5.1 X6.1 ; port +3.3M
+3.3MCU: B1.3 C66.1 C67.1 C68.1 C70.2 C71.2 C72.2 C73.2 C74.2 DD3.19(VDD) DD3.32(VDD) DD3.48(VDD) DD3.64(VDD) DD4.8(VCC) L5.2 R58.2 R59.2 R60.2 TP31.1
+3ADC: C63.1 C65.2 DD1.1(DVDD) DD2.1(DVDD) L4.2 TP30.1
+5 USB: DA15.1(VBUS1) DD3.43(PA10)
+5ADC: C55.1 C56.1 DD1.16(REFP) DD1.18(AVDD) DD2.16(REFP) DD2.18(AVDD) ; port +5ADC
+12: C50.1 C52.1 DA14.12(V+) ; port +12
-12: C49.1 C51.1 DA14.3(V-) ; port -12
GNDA: C48.2 C49.2 C50.2 C51.2 C52.2 C55.2 C56.2 C57.1 C58.1 C59.2 C60.1 C61.2 C62.2 DA14.10(LOG_R) DD1.12(AINN1) DD1.13(AINN2) DD1.14(AINP2) DD1.15(REFN) DD1.17(AGND) DD2.12(AINN1) DD2.13(AINN2) DD2.14(AINP2) DD2.15(REFN) DD2.17(AGND) DD3.12(VSSA) ZQ1.2 ZQ1.4 ; port GNDA
GNDD: BQ1.1 BQ2.1 C63.2 C64.1 C65.1 C66.2 C67.2 C68.2 C69.1 C70.1 C71.1 C72.1 C73.1 C74.1 DA15.2(GND1) DA15.3(VDD1) DA15.4(PDEN) DA15.5(SPU) DA15.8(GND1) DA15.9(GND2) DA15.12(PIN) DA15.13(SPD) DA15.14(VDD2) DA15.15(GND2) DD1.2(DGND) DD1.4(XTAL2) DD2.2(DGND) DD2.4(XTAL2) DD2.5(DGND) DD2.6(DGND) DD2.7(TEMP) DD2.8(A0) DD3.18(VSS) DD3.31(VSS) DD3.47(VSS) DD3.63(VSS) DD4.2(A1) DD4.3(A2) DD4.4(GND) R57.2 X6.20 X7.4 ; port GNDD  [project net GND]
1D_N: DD3.44(PA11) R52.1
1D_P: DD3.45(PA12) R53.1
1GAIN0: DD2.19(GAIN0) DD3.25(PC5)
1GAIN1: DD2.20(GAIN1) DD3.24(PC4)
2D_N: DA15.6(UD-) R52.2
2D_P: DA15.7(UD+) R53.2
3D_N: DA15.11(DD+) R54.1
3D_P: DA15.10(DD+) R55.1
4D_N: R54.2 X7.2
4D_P: R55.2 X7.3
DRDY: DD1.24(DRDY) DD3.22(PA6)
DRDY1: DD2.24(DRDY) DD3.35(PB14)
GAIN0: DD1.19(GAIN0) DD3.51(PC10)
GAIN1: DD1.20(GAIN1) DD3.52(PC11)
LOGIC: DD3.11(PC3)
M1: DD3.26(PB0) R?#1.2 ; port Meandr_1
M2: DD3.27(PB1) R?#2.2 ; port Meandr_2
MEM SCL: DD3.29(PB10) DD4.6(SCL) R59.1
MEM SDA: DD3.30(PB11) DD4.5(SDA) R60.1
MEM WP: DD3.28(PB2) DD4.7(WP) R58.1
OFF ADJ: DA14.14(OFF) DD3.10(PC2)
PDWN: DD1.22(PDWN) DD3.40(PC9)
PDWN1: DD2.22(PDWN) DD3.37(PC6)
SCLK: DD1.23(SCLK) DD3.21(PA5)
SCLK1: DD2.23(SCLK) DD3.34(PB13)
SPEED: DD1.21(SPEED) DD3.39(PC8)
SPEED1: DD2.21(SPEED) DD3.38(PC7)
SWCLK: DD3.49(PA14) X6.9
SWIO: DD3.46(PA13) X6.7
NetB1_1: B1.1 R57.1
NetB1_2: B1.2 DD3.60(BOOT0)
NetBQ1_2: BQ1.2 DD2.3(XTAL1)
NetBQ2_2: BQ2.2 DD1.3(XTAL1)
NetC47_1: DD2.11(AINP1) ; port M_ECG
NetC48_1: C48.1 DA14.8(CH)
NetC53_1: C53.1 DD1.9(CAP)
NetC53_2: C53.2 DD1.10(CAP)
NetC54_1: C54.1 DD2.9(CAP)
NetC54_2: C54.2 DD2.10(CAP)
NetC57_2: C57.2 DD3.7(NRST)
NetC61_1: C61.1 R56.2 ZQ1.1
NetC62_1: C62.1 DD3.5(OSC_IN) ZQ1.3
NetDA14_1: DA14.1(IN) ; port M_REO
NetDA14_7: DA14.7(OUT) DD1.11(AINP1)
NetDA14_11: DA14.11(LOGIC) R?#1.1 R?#2.1
NetDA15_16: DA15.16(VBUS2) X7.1
NetDD1_5: DD1.5(DGND) DD1.6(DGND) DD1.7(TEMP) DD1.8(A0)
NetDD3_6: DD3.6(OSC_OUT) R56.1

Not connected (* = marked no-connect by the designer): DD3 2(PC13) 3(PC14) 4(PC15) 8(PC0) 9(PC1) 14(PA0) 15(PA1) 16(PA2) 17(PA3) 20(PA4) 23(PA7) 33(PB12) 36(PB15) 41(PA8) 42(PA9) 50(PA15) 53(PC12) 54(PD2) 55(PB3) 56(PB4) 57(PB5) 58(PB6) 59(PB7) 61(PB8) 62(PB9); DD4 1(NC); X6 2 3 4 5 6 8 10 11 12 13 14 15 16 17 18 19

### Layout directives
differential pair: 1D_N, 1D_P, 2D_N, 2D_P, 3D_N, 3D_P, 4D_N, 4D_P

### Notes on the sheet
- (near X7) D-
- (near X7) D+
- Перв. примен.
- Справ. №
- Подп. и дата
- Инв. № дубл.
- Взам. инв. №
- Инв. № подл.
- Изм.
- Лист
- № докум.
- Подп.
- Дата
- 2.106-A2
- Копировал
- Формат А2
- (in symbol 128Kb I2C 1MHz) EEPROM
- (in symbol Slide switch SPDT) R; L
- (in symbol STM32F103 lqfp64 64kb, part A) MCU; 3.3V; 5V; PORT A
- (in symbol STM32F103 lqfp64 64kb, part B) MCU; 3.3V; 5V; PORT B
- (in symbol STM32F103 lqfp64 64kb, part C) MCU; 3.3V; 5V; PORT C
- (in symbol STM32F103 lqfp64 64kb, part D) MCU; PD0; 5V; PD1

### Library data of the parts
B1 = Slide switch SPDT: Code: -; Name: -
BQ1 BQ2 = SMD 4.9152MHz 2pin 10.3x4.5 16pF_1: Name: Резонатор кварцевый HC49SM 7.3728 MHz; Code: 6321974907; Parameter 1: 7.3728 MHz
C48 = 0.01u 50V 0805 ±5%: Code: 6279261451; Name: Конденсатор X7R 50V  0,01uF±5%  0805
C49 C50 = 10u 50V 0805 ±10%: as C16 on sheet POWER
C51 C52 = 0.1u 50V 0805 ±10%: as C1 on sheet Generator_REO
C53-C57 C63-C65 C67 C69-C74 = 0.1u 50V 0603 ±10%: CC0603KRX7R9BB104; Code: 6279259871; Name: Конденсатор X7R 50V 0,1uF +-10% 0603
C58 C59 = 0.01u 100V 0603 ±10%: Code: 6270003321; Name: Конденсатор СС0603KRX7R0BB104, Yageo
C60 = 1u 16V 0603 ±10%: Code: 62193105441; Name: Конденсатор 0603-NPO-25В-1000
C61 C62 = 22p 50V 0603 ±5%: Code: 6219310401; Name: Конденсатор 0603CG220J500NT, Fenghua
C66 = 0.22u 50V 0603 ±10% analogue: Code: 6270001221; Name: Конденсатор X7R 50V 0,22uF±10% 0603
C68 = 4.7u 25V 0805 ±10%: as C13 on sheet POWER
DA14 = LF398MX
DA15 = USB ADuM4160: Name: Микросхема ADuM4160
DD3 = STM32F103 lqfp64 64kb: Code: 6335530806; Name: Микросхема STM32F103RBT6
DD4 = 128Kb I2C 1MHz: Code: 6339110311; Name: Микросхема M24M01-RMN6TP, ST
L4 L5 = 600Ohm 0,8A: Code: 6310011671; Name: Дроссель BLM18HE601SN1D, Murata
R52-R55 = 27 ±1% 0603: Code: 6069180381; Name: Резистор 27R±1% 0603
R56 = 1k ±1% 0603: as R4 on sheet Generator_REO
R57 = 10k ±1% 0603: Code: 6069191961; Name: Резистор 10K+-1% TK50 0603
R58-R60 = 1k ±1%: Code: 6069174188; Name: Резистор 1k ±1% 0603
R?#1 R?#2 = 0 ±5%: Code: 6020004221; Name: Резистор RC0603JR-070RL, Yageo
X6 = 20 pin IDC BH20 2.54: Code: 6313922720; Name: Вилка BH-20 Импорт
X7 = 4 pin USB
ZQ1 = SMD 8MHz 4pin 3.2x2.5 22pF: Code: 6329545441; Name: Резонатор кварцевый KT-7X 8.0 MHz

## Nets that join several sheets
+1.65: REO_ECG (TP22.1), Generator_REO (R4.1), POWER (C9.1 R16.1 R17.2), ECG (C44.2 DA12.5)
+3.3: REO_ECG (TP14.1), POWER (C11.1 DA4.2 DA4.4 R16.2), ECG (C39.1 C46.1 DA11.5 DA13.5), INTERFACES (5 pins)
+3.3ADC: REO_ECG (TP19.1), POWER (C12.1 DA5.2 DA5.4), INTERFACES (C64.2 L4.1)
+3.3M: REO_ECG (TP16.1), POWER (C10.1 DA3.2 DA3.4), INTERFACES (C69.2 L5.1 X6.1)
+5: REO_ECG (TP7.1), POWER (14 pins)
+5ADC: REO_ECG (TP9.1), POWER (DA6.7), INTERFACES (6 pins)
+5C: REO_ECG (TP8.1 X4.1), POWER (C19.1 DA8.1 R19.2)
+12: REO_ECG (TP12.1), Generator_REO (C1.2 C2.2 DA1.8 DA2.8), Measurement_REO (C33.2 C35.2 DA9.8 DA10.8), POWER (R27.2), ECG (C45.1 DA12.7), INTERFACES (C50.1 C52.1 DA14.12)
+P: REO_ECG (X3.1), POWER (C26.1 L3.2 R30.2)
-12: REO_ECG (TP10.1), Generator_REO (C3.2 C4.2 DA1.4 DA2.4), Measurement_REO (C34.1 C36.1 DA9.4 DA10.4), POWER (R26.2), ECG (C43.1 DA12.4), INTERFACES (C49.1 C51.1 DA14.3)
GND: REO_ECG (R1.2 TP2.1), Generator_REO (R5.1), POWER (C10.2 C12.2 DA3.1 DA5.1), INTERFACES (42 pins)
GNDA: REO_ECG (R1.1 TP1.1 X3.2 X4.5), Generator_REO (8 pins), Measurement_REO (10 pins), POWER (31 pins), ECG (11 pins), INTERFACES (27 pins)
INGEN: REO_ECG (TP11.1 X2.3), Measurement_REO (C31.2)
M1: REO_ECG (TP3.1), Generator_REO (R2.1), INTERFACES (DD3.26 R?#1.2)
M2: REO_ECG (TP6.1), Generator_REO (R3.1), INTERFACES (DD3.27 R?#2.2)
NetC7_1: REO_ECG (TP15.1 X2.4), Generator_REO (C7.1)
NetC8_1: REO_ECG (TP17.1 X2.2), Generator_REO (C8.1)
NetC32_2: REO_ECG (TP13.1 X2.1), Measurement_REO (C32.2)
NetC40_2: REO_ECG (TP20.1 X1.2), ECG (C40.2)
NetC41_2: REO_ECG (TP21.1 X1.1), ECG (C41.2)
NetC42_2: REO_ECG (TP18.1 X1.3), ECG (C42.2 DA11.1 R44.1)
NetC47_1: REO_ECG (TP5.1), ECG (C47.1 R51.2 TP29.1), INTERFACES (DD2.11)
NetDA14_1: REO_ECG (TP4.1), Measurement_REO (R42.2 R43.2), INTERFACES (DA14.1)